# EAGLE design rgb_pov_single (EAGLE 5.01)
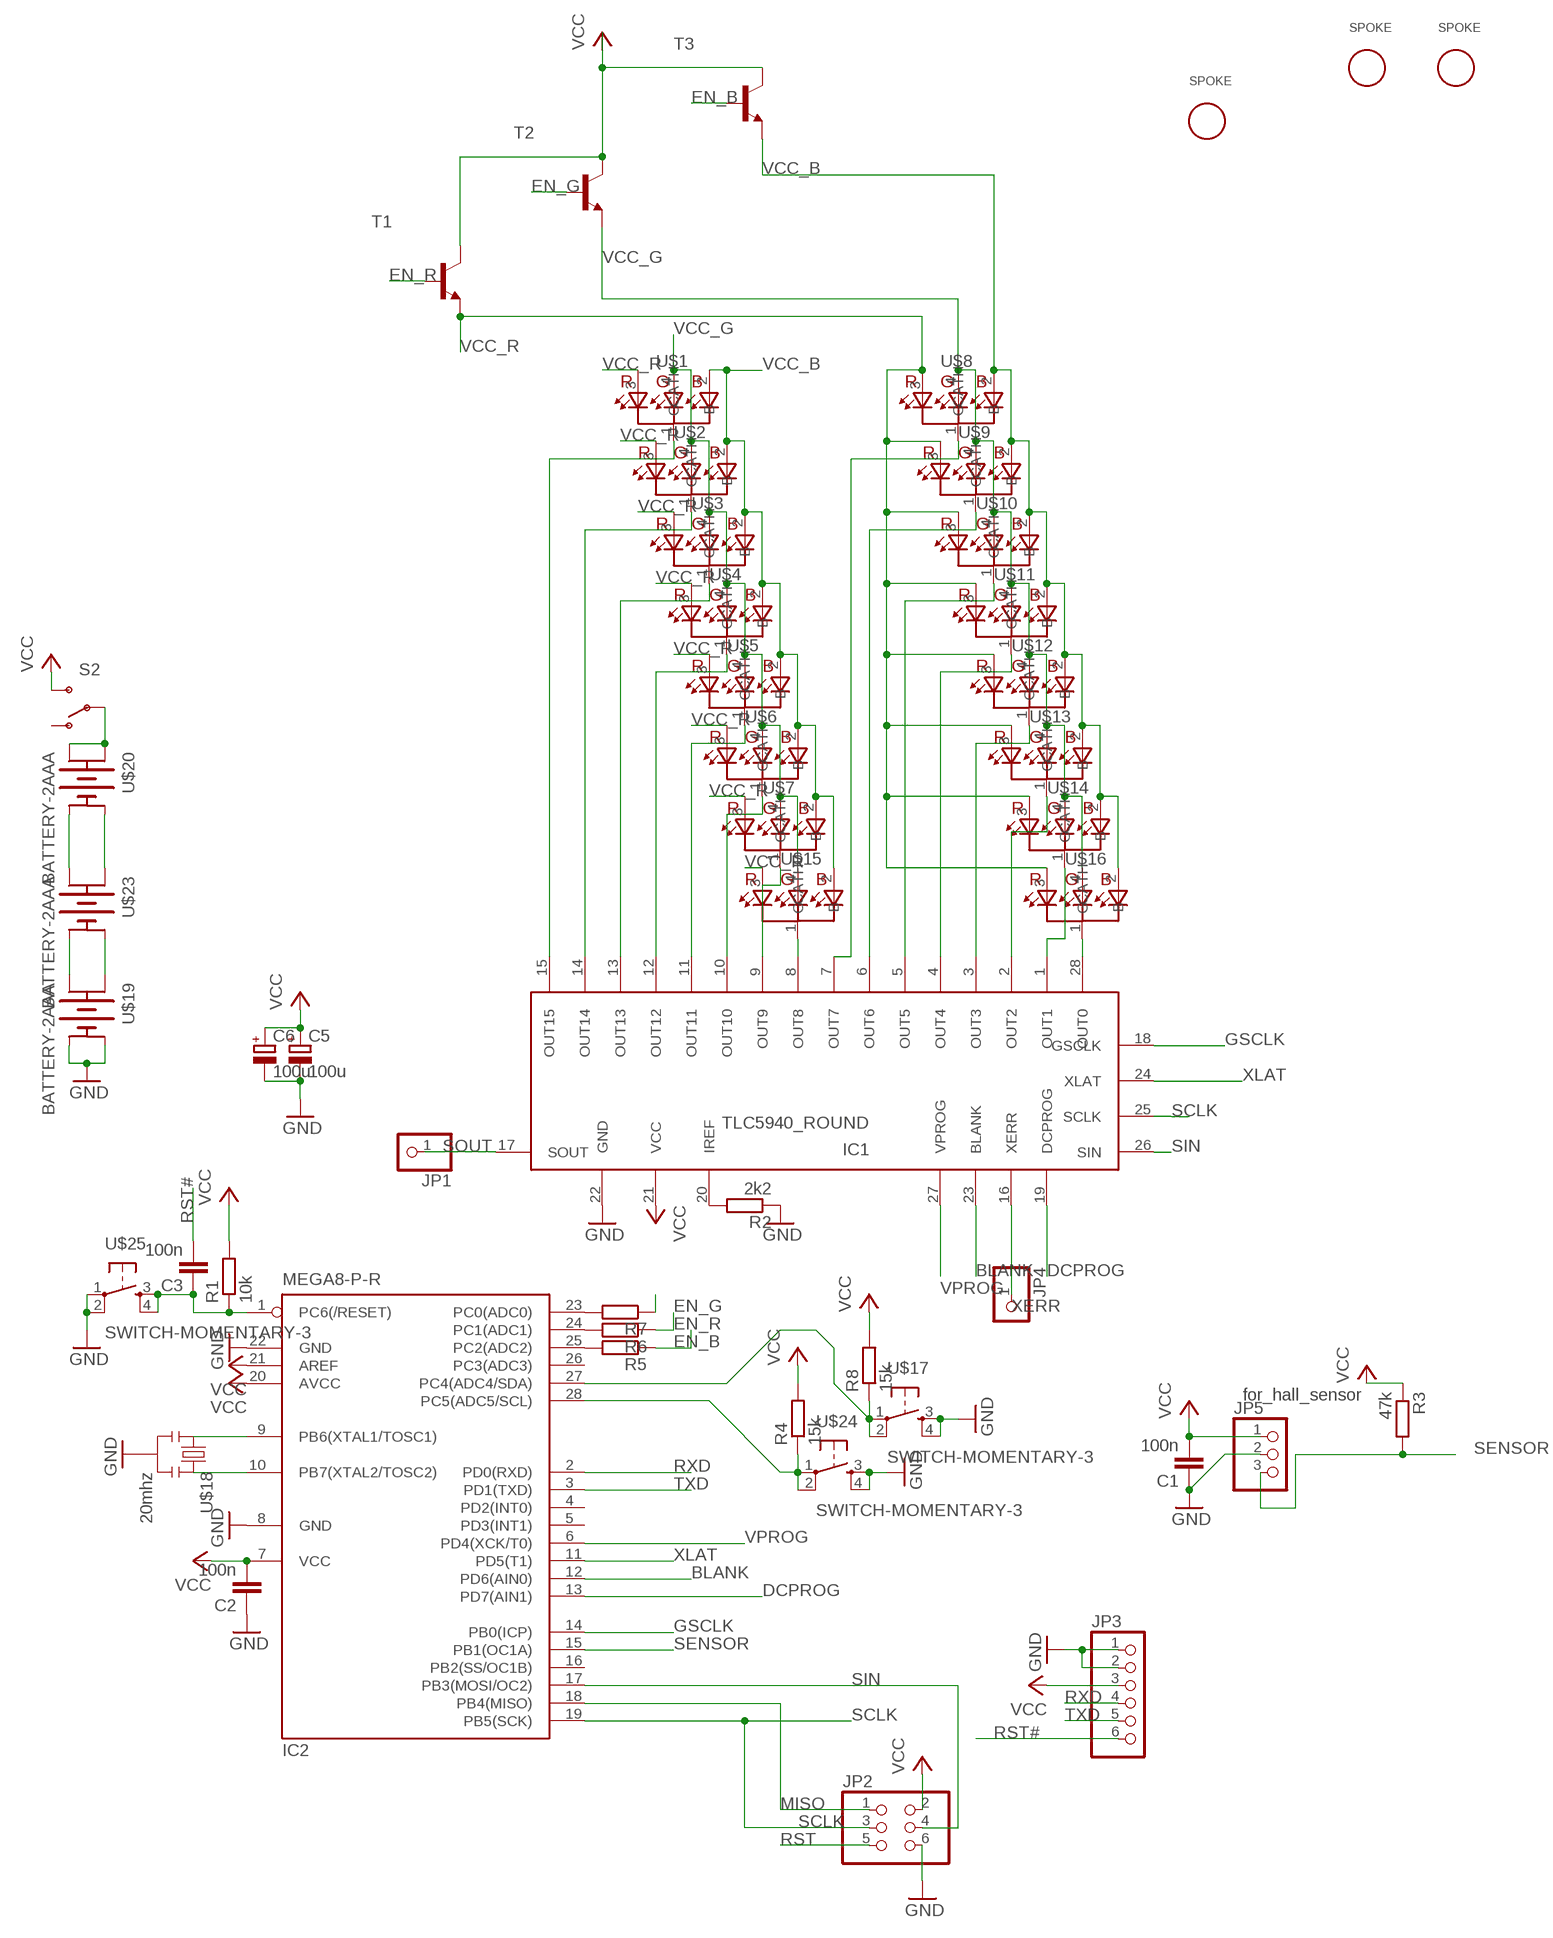
[diagram p0: schematic, sheet 1]

## Parts
1  SPOKE  [SPOKE]
2  SPOKE  [SPOKE]
3  SPOKE  [SPOKE]
C1  100n  C-EU025-025X050  [C025-025X050]
C2  100n  C-EU025-025X050  [C025-025X050]
C3  100n  C-EU025-025X050  [C025-025X050]
C5  100u  CPOL-EUE2,5-6E  [E2,5-6E]
C6  100u  CPOL-EUE2,5-6E  [E2,5-6E]
IC1  TLC5940_ROUND  [DIP28S_ROUND]
IC2  MEGA8-P-R  [DIL28-3-R]
JP1  PINHD-1X1_2  [1X01_2]
JP2  PINHD-2X3  [2X03]
JP3  PINHD-1X6  [1X06]
JP4  PINHD-1X1_2  [1X01_2]
JP5  PINHD-1X3_2  [1X03_2]
R1  10k  R-EU_0204/7  [0204/7]
R2  2k2  R-EU_0207/15  [0207/15]
R3  47k  R-EU_0207/10  [0207/10]
R4  15k  R-EU_0204/7  [0204/7]
R5  R-EU_0207/12  [0207/12]
R6  R-EU_0207/12  [0207/12]
R7  R-EU_0207/12  [0207/12]
R8  15k  R-EU_0204/7  [0204/7]
S2  SWITCH-SPSTPTH  [SWITCH-SPDT]
T1  2N2222-NPN-TO92-EBC  [TO92-EBC]
T2  2N2222-NPN-TO92-EBC  [TO92-EBC]
T3  2N2222-NPN-TO92-EBC  [TO92-EBC]
U$1  LED_SUPERFLUX_RGB_CATH  [LED_SUPERFLUX]
U$2  LED_SUPERFLUX_RGB_CATH  [LED_SUPERFLUX]
U$3  LED_SUPERFLUX_RGB_CATH  [LED_SUPERFLUX]
U$4  LED_SUPERFLUX_RGB_CATH  [LED_SUPERFLUX]
U$5  LED_SUPERFLUX_RGB_CATH  [LED_SUPERFLUX]
U$6  LED_SUPERFLUX_RGB_CATH  [LED_SUPERFLUX]
U$7  LED_SUPERFLUX_RGB_CATH  [LED_SUPERFLUX]
U$8  LED_SUPERFLUX_RGB_CATH  [LED_SUPERFLUX]
U$9  LED_SUPERFLUX_RGB_CATH  [LED_SUPERFLUX]
U$10  LED_SUPERFLUX_RGB_CATH  [LED_SUPERFLUX]
U$11  LED_SUPERFLUX_RGB_CATH  [LED_SUPERFLUX]
U$12  LED_SUPERFLUX_RGB_CATH  [LED_SUPERFLUX]
U$13  LED_SUPERFLUX_RGB_CATH  [LED_SUPERFLUX]
U$14  LED_SUPERFLUX_RGB_CATH  [LED_SUPERFLUX]
U$15  LED_SUPERFLUX_RGB_CATH  [LED_SUPERFLUX]
U$16  LED_SUPERFLUX_RGB_CATH  [LED_SUPERFLUX]
U$17  SWITCH-MOMENTARY-3  [TACTILE-PTH]
U$18  20mhz  RESONATORPTH  [RESONATOR-PTH]
U$19  BATTERY-2AAA  [BATTERY-AAA]
U$20  BATTERY-2AAA  [BATTERY-AAA]
U$23  BATTERY-2AAA  [BATTERY-AAA]
U$24  SWITCH-MOMENTARY-3  [TACTILE-PTH]
U$25  SWITCH-MOMENTARY-3  [TACTILE-PTH]

## Nets
BLANK: IC1.23(BLANK) IC2.12(PD6(AIN0))
DCPROG: IC1.19(DCPROG) IC2.13(PD7(AIN1))
EN_B: R5.1 T3.B
EN_G: R7.1 T2.B
EN_R: R6.1 T1.B
GND: C1.1 C2.1 C5.- C6.- IC1.22(GND) IC2.8(GND) IC2.22(GND) JP2.6 JP3.1 JP3.2 JP5.2 R2.1 U$17.3 U$17.4 U$18.2 U$19.GND@1(-1) U$19.GND@2(-2) U$24.3 U$24.4 U$25.1 U$25.2
GSCLK: IC1.18(GSCLK) IC2.14(PB0(ICP))
MISO: IC2.18(PB4(MISO)) JP2.1
N$1: IC1.28(OUT0) U$16.1(CATH)
N$2: IC1.1(OUT1) U$14.1(CATH)
N$3: IC1.2(OUT2) U$13.1(CATH)
N$4: IC1.3(OUT3) U$12.1(CATH)
N$5: IC1.4(OUT4) U$11.1(CATH)
N$6: IC1.5(OUT5) U$10.1(CATH)
N$7: IC1.6(OUT6) U$9.1(CATH)
N$8: IC1.7(OUT7) U$8.1(CATH)
N$9: IC1.20(IREF) R2.2
N$10: IC1.8(OUT8) U$15.1(CATH)
N$11: IC1.9(OUT9) U$7.1(CATH)
N$12: IC1.10(OUT10) U$6.1(CATH)
N$13: IC1.11(OUT11) U$5.1(CATH)
N$14: IC1.12(OUT12) U$4.1(CATH)
N$15: IC1.13(OUT13) U$3.1(CATH)
N$16: IC1.14(OUT14) U$2.1(CATH)
N$17: IC1.15(OUT15) U$1.1(CATH)
N$18: U$20.GND@2(-2) U$23.PWR@2(+2)
N$19: IC2.10(PB7(XTAL2/TOSC2)) U$18.3
N$20: IC2.9(PB6(XTAL1/TOSC1)) U$18.1
N$21: U$20.GND@1(-1) U$23.PWR@1(+1)
N$22: U$19.PWR@1(+1) U$23.GND@1(-1)
N$23: U$19.PWR@2(+2) U$23.GND@2(-2)
N$24: IC2.28(PC5(ADC5/SCL)) R4.1 U$24.1 U$24.2
N$25: S2.2(P) U$20.PWR@1(+1) U$20.PWR@2(+2)
N$26: IC2.25(PC2(ADC2)) R5.2
N$27: IC2.24(PC1(ADC1)) R6.2
N$28: IC2.23(PC0(ADC0)) R7.2
N$29: IC2.27(PC4(ADC4/SDA)) R8.1 U$17.1 U$17.2
RST: C3.1 IC2.1(PC6(/RESET)) JP2.5 R1.1 U$25.3 U$25.4
RST#: C3.2 JP3.6
RXD: IC2.2(PD0(RXD)) JP3.4
SCLK: IC1.25(SCLK) IC2.19(PB5(SCK)) JP2.3
SENSOR: IC2.15(PB1(OC1A)) JP5.3 R3.2
SIN: IC1.26(SIN) IC2.17(PB3(MOSI/OC2)) JP2.4
SOUT: IC1.17(SOUT) JP1.1
TXD: IC2.3(PD1(TXD)) JP3.5
VCC: C1.2 C2.2 C5.+ C6.+ IC1.21(VCC) IC2.7(VCC) IC2.20(AVCC) IC2.21(AREF) JP2.2 JP3.3 JP5.1 R1.2 R3.1 R4.2 R8.2 S2.3(S) T1.C T2.C T3.C
VCC_B: T3.E U$1.2(B) U$2.2(B) U$3.2(B) U$4.2(B) U$5.2(B) U$6.2(B) U$7.2(B) U$8.2(B) U$9.2(B) U$10.2(B) U$11.2(B) U$12.2(B) U$13.2(B) U$14.2(B) U$15.2(B) U$16.2(B)
VCC_G: T2.E U$1.4(G) U$2.4(G) U$3.4(G) U$4.4(G) U$5.4(G) U$6.4(G) U$7.4(G) U$8.4(G) U$9.4(G) U$10.4(G) U$11.4(G) U$12.4(G) U$13.4(G) U$14.4(G) U$15.4(G) U$16.4(G)
VCC_R: T1.E U$1.3(R) U$2.3(R) U$3.3(R) U$4.3(R) U$5.3(R) U$6.3(R) U$7.3(R) U$8.3(R) U$9.3(R) U$10.3(R) U$11.3(R) U$12.3(R) U$13.3(R) U$14.3(R) U$15.3(R) U$16.3(R)
VPROG: IC1.27(VPROG) IC2.6(PD4(XCK/T0))
XERR: IC1.16(XERR) JP4.1
XLAT: IC1.24(XLAT) IC2.11(PD5(T1))
Unconnected: IC2.4(PD2(INT0)) IC2.5(PD3(INT1)) IC2.16(PB2(SS/OC1B)) IC2.26(PC3(ADC3)) S2.1(O)

## Notes on the sheet
- for_hall_sensor

## Library data of the parts
1-3 = hazard:SPOKE
C1-C3 = rcl:C-EU: CAPACITOR, European symbol
C5 C6 = rcl:CPOL-EU: POLARIZED CAPACITOR, European symbol
IC1 = hazard:TLC5940: TLC5940 16 CHANNEL LED DRIVER WITH DOT CORRECTION AND GRAYSCALE PWM CONTROL
IC2 = atmel:MEGA8-P: MICROCONTROLLER 8 Kbytes FLASH, 1 kbytes SRAM, 512 bytes EEPROM, USART, 4-channel 10 bit ADC, 2-channel 8 bit ADC Pin compatible with Atmega48, ATMega88, ATMega168 Source: avr.lbr
JP1 JP4 = pinhead:PINHD-1X1: PIN HEADER
JP2 = pinhead:PINHD-2X3: PIN HEADER
JP3 = pinhead:PINHD-1X6: PIN HEADER
JP5 = pinhead:PINHD-1X3: PIN HEADER
R1-R8 = rcl:R-EU_: RESISTOR, European symbol
S2 = SparkFun:SWITCH-SPST: SPST Switch Simple slide switch. Spark Fun Electronics SKU : COM-00102
T1-T3 = transistor-neu-to92:*-NPN-: NPN Transistror
U$1-U$16 = hazard:LED_SUPERFLUX_RGB_CATH
U$17 U$24 U$25 = SparkFun:SWITCH-MOMENTARY-3
U$18 = SparkFun:RESONATOR: Resonator Small SMD resonator. This is the itty bitty 10/20MHz resonators with built in caps. CSTCE10M0G55 and CSTCE20M0V53. Footprint has been reviewed closely but hasn't been tested yet.
U$19 U$20 U$23 = SparkFun:BATTERY-2

## Board
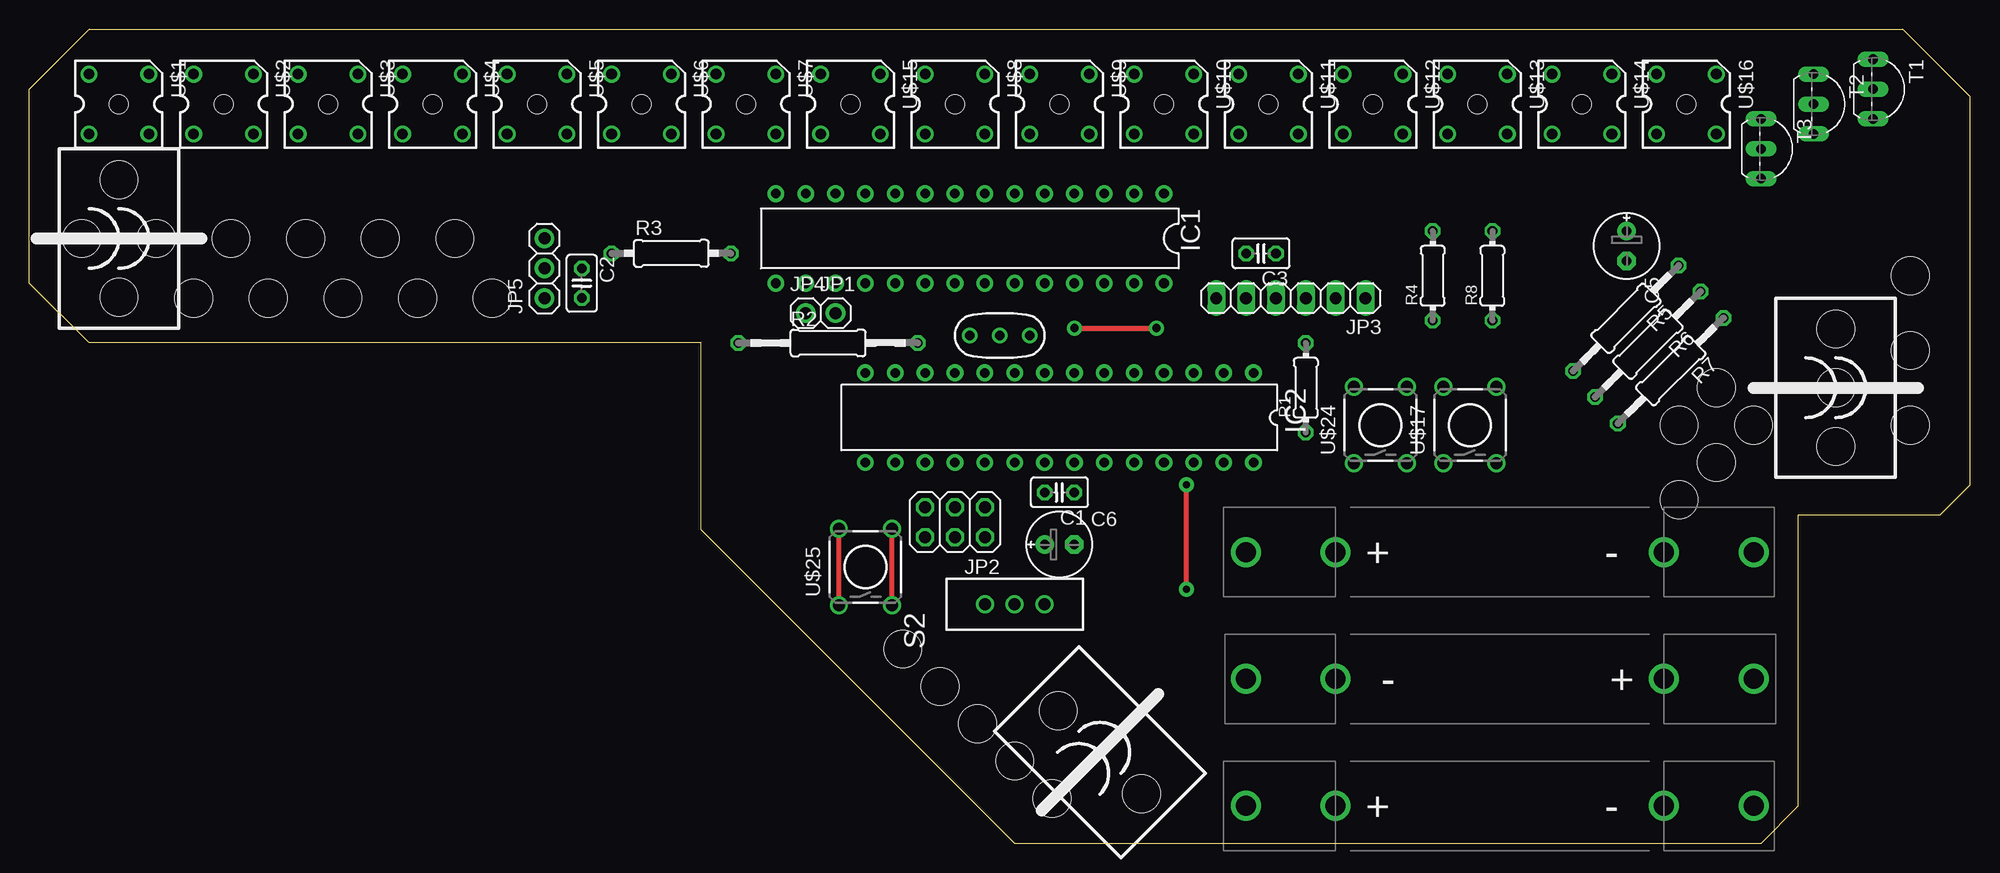
[diagram p1: board, top side]
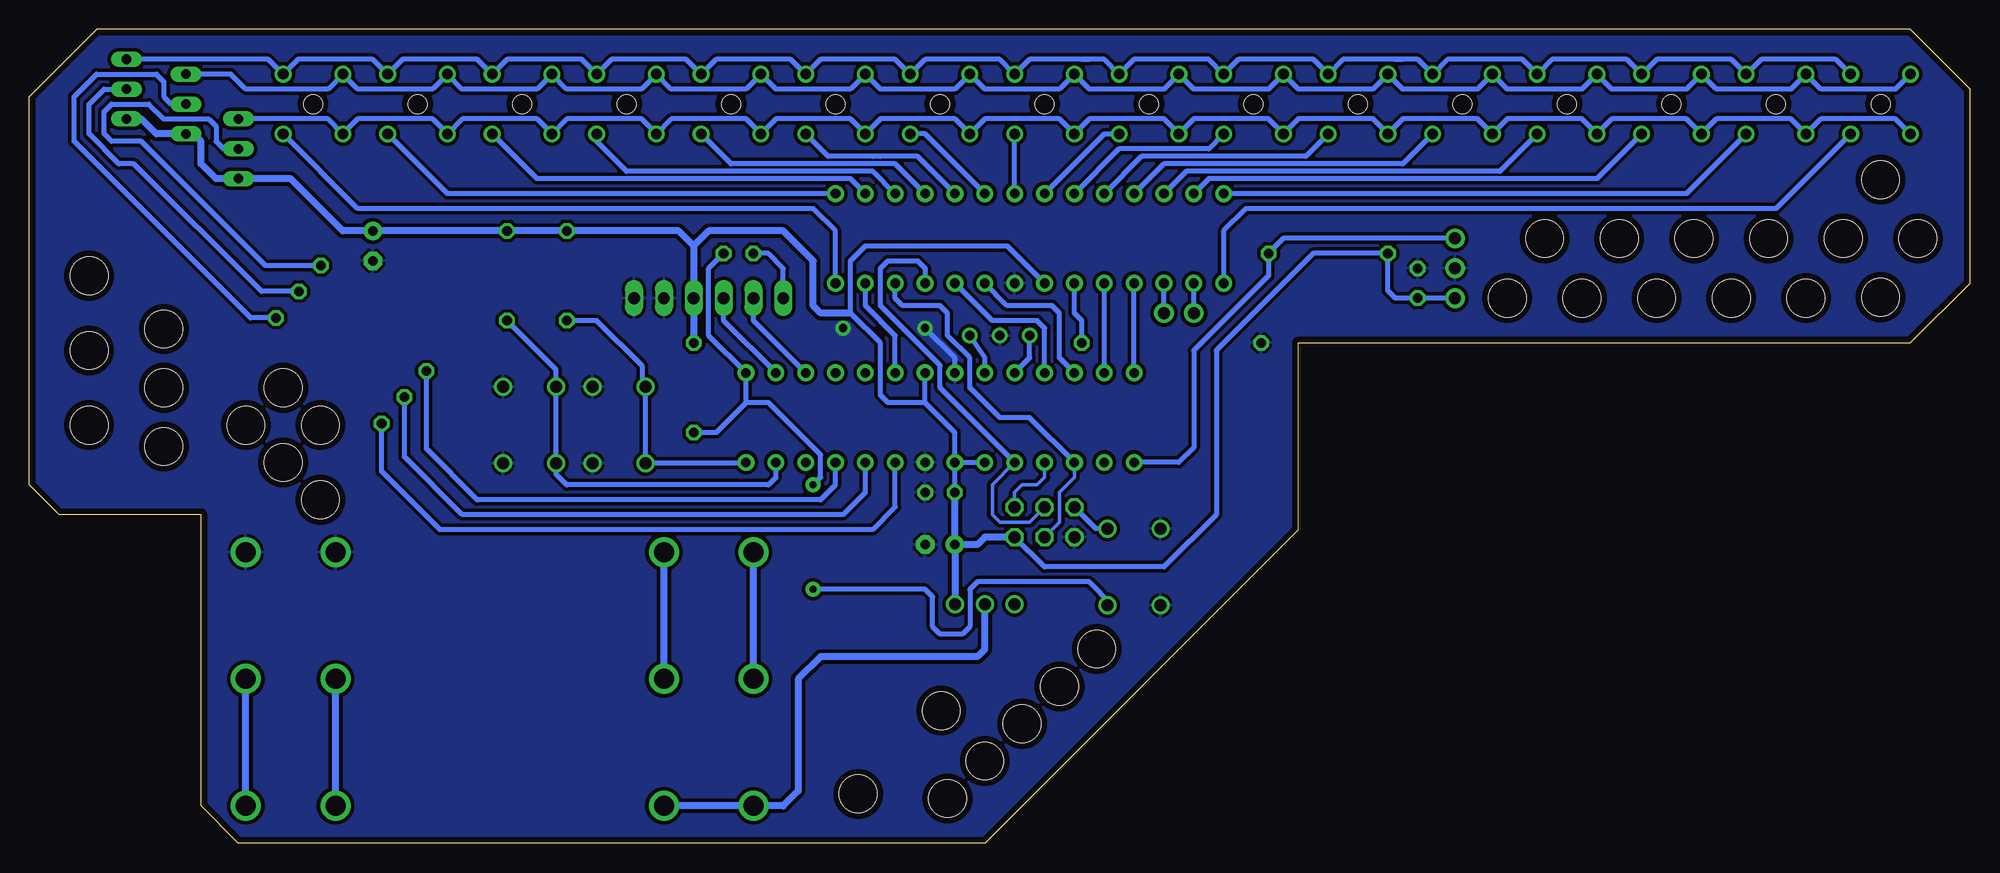
[diagram p2: board, bottom side, seen from below]

Size 165.1 x 69.21 mm. Coordinates in mm from the lower left corner, seen from the top.
Outline: 57.15,26.67 57.15,42.55 5.08,42.55 0,47.62 0,64.13 5.08,69.21 159.38,69.21 165.1,63.5 165.1,30.48 162.56,27.94 150.5,27.94 150.5,3.17 147.32,0 83.82,0 57.15,26.67
Copper layers (1*16): Top 0.035mm / dielectric 1.5mm / Bottom 0.035mm
Design rules "default *": minimum track width 10mil, minimum drill 24mil, track to track 12mil, track to pad 12mil, pad to pad 12mil, via to via 12mil, smd to smd 8mil, copper to edge 20mil, drill to drill 8mil, minimum pad ring 10mil, minimum via ring 8mil, stop-mask expansion 4mil, vias tented up to drill 0mil, thermal gap 10mil
Holes 1.6 mm at 7.62,62.87 16.51,62.87 25.4,62.87 34.29,62.87 43.18,62.87 52.07,62.87 60.96,62.87 69.85,62.87 78.74,62.87 87.63,62.87 96.52,62.87 105.41,62.87 114.3,62.87 123.19,62.87 132.08,62.87 140.97,62.87
Holes 3.2 mm at 13.97,46.36 20.32,46.36 26.67,46.36 33.02,46.36 39.37,46.36 36.2,51.44 29.85,51.44 23.5,51.44 17.15,51.44 10.79,51.44 4.45,51.44 153.67,38.73 160.02,35.56 160.02,41.91 160.02,48.26 146.69,35.56 143.51,38.73 143.51,32.39 140.33,35.56 140.33,29.21 87,3.81 83.82,6.99 74.3,16.51 80.65,10.16 77.47,13.34

### Footprints (pad centres in the part's own frame; a part is rotated, then mirrored left to right if it is on the bottom)
SPOKE = hole 3.2: 0,-5; 0,5
C025-025X050 = drill 0.813 octagon: 1 -1.27,0; 2 1.27,0
E2,5-6E = drill 0.813 pad 1.575 round: + -1.27,0 | drill 0.813 pad 1.575 octagon: - 1.27,0
DIP28S_ROUND = drill 0.813 pad 1.422 round: 1 0,0; 2 2.54,0; 3 5.08,0; 4 7.62,0; 5 10.16,0; 6 12.7,0; 7 15.24,0; 8 17.78,0; 9 20.32,0; 10 22.86,0; 11 25.4,0; 12 27.94,0; 13 30.48,0; 14 33.02,0; 15 33.02,7.62; 16 30.48,7.62; 17 27.94,7.62; 18 25.4,7.62; 19 22.86,7.62; 20 20.32,7.62; 21 17.78,7.62; 22 15.24,7.62; 23 12.7,7.62; 24 10.16,7.62; 25 7.62,7.62; 26 5.08,7.62; 27 2.54,7.62; 28 0,7.62
DIL28-3-R = drill 0.813 pad 1.422 round: 1 -16.51,-3.81; 2 -13.97,-3.81; 3 -11.43,-3.81; 4 -8.89,-3.81; 5 -6.35,-3.81; 6 -3.81,-3.81; 7 -1.27,-3.81; 8 1.27,-3.81; 9 3.81,-3.81; 10 6.35,-3.81; 11 8.89,-3.81; 12 11.43,-3.81; 13 13.97,-3.81; 14 16.51,-3.81; 15 16.51,3.81; 16 13.97,3.81; 17 11.43,3.81; 18 8.89,3.81; 19 6.35,3.81; 20 3.81,3.81; 21 1.27,3.81; 22 -1.27,3.81; 23 -3.81,3.81; 24 -6.35,3.81; 25 -8.89,3.81; 26 -11.43,3.81; 27 -13.97,3.81; 28 -16.51,3.81
1X01_2 = drill 1.016 pad 1.676 round: 1 0,0
2X03 = drill 1.016 octagon: 1 -2.54,-1.27; 2 -2.54,1.27; 3 0,-1.27; 4 0,1.27; 5 2.54,-1.27; 6 2.54,1.27
1X06 = drill 1.016 long: 1 -6.35,0; 2 -3.81,0; 3 -1.27,0; 4 1.27,0; 5 3.81,0; 6 6.35,0
1X03_2 = drill 1.016 pad 1.676 round: 1 -2.54,0; 2 0,0; 3 2.54,0
0204/7 = drill 0.813 octagon: 1 -3.81,0; 2 3.81,0
0207/15 = drill 0.813 octagon: 1 -7.62,0; 2 7.62,0
0207/10 = drill 0.813 octagon: 1 -5.08,0; 2 5.08,0
0207/12 = drill 0.813 octagon: 1 -6.35,0; 2 6.35,0
SWITCH-SPDT = drill 1.016 round: 1 0,2.54; 2 0,0; 3 0,-2.54
TO92-EBC = drill 0.813 long: B 0,-1.27; C 2.54,-1.27; E -2.54,-1.27
LED_SUPERFLUX = drill 0.9 pad 1.422 round: 1 0,5.08; 2 5.08,5.08; 3 0,0; 4 5.08,0
TACTILE-PTH = drill 1.016 round: 1 -3.251,2.261; 2 3.251,2.261; 3 -3.251,-2.261; 4 3.251,-2.261
RESONATOR-PTH = drill 0.8 round: 1 -2.54,0; 2 0,0; 3 2.54,0
BATTERY-AAA = drill 1.702 round: GND@1 21.59,0; GND@2 13.97,0; PWR@1 -21.59,0; PWR@2 -13.97,0

### Placement (x,y rotation side)
1  7.62,51.44 0 top
2  153.67,38.73 0 top
3  91.07,7.74 45 top
C1  87.63,29.84 180 top
C2  46.99,47.62 270 top
C3  104.78,50.16 180 top
C5  135.89,50.8 270 top
C6  87.63,25.4 0 top
IC1  96.52,55.25 180 top
IC2  87.63,36.2 180 top
JP1  68.58,45.09 0 top
JP2  78.74,27.3 180 top
JP3  107.32,46.36 180 top
JP4  66.04,45.09 0 top
JP5  43.81,48.9 90 top
R1  108.59,38.73 90 top
R2  67.95,42.55 0 top
R3  54.61,50.16 0 top
R4  119.38,48.26 90 top
R5  135.81,44.64 225 top
R6  137.69,42.44 225 top
R7  139.62,40.19 225 top
R8  124.46,48.26 90 top
S2  83.82,20.32 90 top
T1  158.11,64.13 270 top
T2  153.03,62.87 270 top
T3  148.59,59.05 270 top
U$1  10.16,65.41 180 top
U$2  19.05,65.41 180 top
U$3  27.94,65.41 180 top
U$4  36.83,65.41 180 top
U$5  45.72,65.41 180 top
U$6  54.61,65.41 180 top
U$7  63.5,65.41 180 top
U$8  81.28,65.41 180 top
U$9  90.17,65.41 180 top
U$10  99.06,65.41 180 top
U$11  107.95,65.41 180 top
U$12  116.84,65.41 180 top
U$13  125.73,65.41 180 top
U$14  134.62,65.41 180 top
U$15  72.39,65.41 180 top
U$16  143.51,65.41 180 top
U$17  122.56,35.56 90 top
U$18  82.55,43.18 180 top
U$19  125.09,24.76 0 top
U$20  125.09,3.17 0 top
U$23  125.09,13.97 180 top
U$24  114.94,35.56 90 top
U$25  71.12,23.49 90 top

### Tracks (layer width: path | path; a pad name or v marks a point on that pad's centre or on a via)
BLANK
  Bottom 0.406: IC2.12 77.47,41.27 77.47,45.09 78.11,45.72 81.92,45.72 IC1.23
DCPROG
  Bottom 0.406: IC2.13 IC1.19
EN_B
  Bottom 0.406: T3.B 148.59,59.05 149.22,59.69 149.22,60.96 149.86,61.59 153.67,61.59 154.94,62.87 158.11,62.87 158.75,62.23 158.75,60.33 158.11,59.69 155.57,59.69 145.01,49.13 R5.1
EN_G
  Bottom 0.406: T2.B 153.03,62.87 153.67,63.5 153.67,64.77 154.3,65.41 159.38,65.41 161.29,63.5 161.29,59.69 146.28,44.68 R7.1
EN_R
  Bottom 0.406: T1.B 158.75,64.13 160.02,62.87 160.02,60.33 157.48,57.79 156.21,57.79 145.35,46.93 R6.1
GND  (via drill 0.7 pad 1.27)
  Top 0.406: v88.9,43.82 v95.89,43.82 | U$25.1 68.66,20.24 68.58,20.32 68.86,20.6 U$25.2
  Bottom 0.406: IC2.8 86.36,41.27 v88.9,43.82
  pour Bottom: 83.82,0 147.32,0 150.5,3.17 150.5,27.94 162.56,27.94 165.1,30.48 165.1,63.5 159.38,69.21 5.08,69.21 0,64.13 0,47.62 5.08,42.55 57.15,42.55 57.15,26.67
GSCLK
  Bottom 0.406: IC2.14 IC1.18
MISO
  Bottom 0.305: JP2.1 81.28,29.84 80.65,30.48 79.38,30.48 78.74,31.11 IC2.18
N$1
  Bottom 0.406: 132.72,53.98 98.43,53.98 96.52,52.07 IC1.28 | 132.72,53.98 133.35,53.98 | U$16.1 137.16,53.98 132.72,53.98
N$2
  Bottom 0.406: U$14.1 129.54,55.25 IC1.1
N$3
  Bottom 0.406: IC1.2 95.25,56.52 121.92,56.52 U$13.1
N$4
  Bottom 0.406: IC1.3 93.34,57.15 114.3,57.15 116.84,59.69 U$12.1
N$5
  Bottom 0.406: IC1.4 91.44,57.79 105.41,57.79 U$11.1
N$6
  Bottom 0.406: IC1.5 89.54,58.42 92.71,58.42 | 92.71,58.42 93.34,58.42 | U$10.1 97.16,58.42 92.71,58.42
N$7
  Bottom 0.406: U$9.1 88.9,60.33 IC1.6
N$8
  Bottom 0.406: IC1.7 U$8.1
N$9
  Bottom 0.406: R2.2 75.57,44.45 76.2,45.09 IC1.20
N$10
  Bottom 0.406: IC1.8 73.66,60.33 U$15.1
N$11
  Bottom 0.406: IC1.9 72.39,59.05 64.77,59.05 U$7.1
N$12
  Bottom 0.406: IC1.10 70.48,58.42 56.52,58.42 U$6.1
N$13
  Bottom 0.406: IC1.11 68.58,57.79 48.26,57.79 U$5.1
N$14
  Bottom 0.406: IC1.12 66.68,57.15 40,57.15 U$4.1
N$15
  Bottom 0.406: IC1.13 64.77,56.52 31.75,56.52 U$3.1
N$16
  Bottom 0.406: IC1.14 24.13,55.25 U$2.1
N$17
  Bottom 0.406: IC1.15 63.5,52.07 61.59,53.98 16.51,53.98 U$1.1
N$18
  Bottom 0.61: U$20.GND@2 U$23.PWR@2
N$19
  Bottom 0.406: IC2.10 80.01,41.27 U$18.3
N$20
  Bottom 0.406: IC2.9 83.82,41.27 U$18.1
N$21
  Bottom 0.61: U$20.GND@1 U$23.PWR@1
N$22
  Bottom 0.61: U$23.GND@1 U$19.PWR@1
N$23
  Bottom 0.61: U$23.GND@2 U$19.PWR@2
N$24
  Bottom 0.406: IC2.28 104.22,32.31 U$24.1 112.67,38.38 113.03,38.73 112.95,38.81 | 112.95,38.81 U$24.2 | 112.95,38.81 112.95,40.56 116.84,44.45 R4.1
N$25
  Bottom 0.61: U$20.PWR@2 U$20.PWR@1 100.97,3.17 99.7,4.45 99.7,13.97 97.79,15.88 84.45,15.88 83.82,16.51 S2.2
N$26
  Bottom 0.406: IC2.25 96.52,30.48 97.79,29.21 127,29.21 131.32,33.53 R5.2
N$27
  Bottom 0.406: IC2.24 93.98,29.84 95.89,27.94 128.27,27.94 133.2,32.87 R6.2
N$28
  Bottom 0.406: IC2.23 91.44,28.57 93.34,26.67 130.17,26.67 135.13,31.63 R7.2
N$29
  Bottom 0.406: IC2.27 101.6,31.11 102.23,30.48 119.38,30.48 120.29,31.39 U$17.1 120.29,38.46 120.02,38.73 120.09,38.81 U$17.2 120.29,40.28 R8.1
RST  (via drill 0.6 pad 1.27)
  Top 0.406: U$25.4 73.58,26.75 73.66,26.67 73.38,26.39 U$25.3 | v98.43,21.59 v98.43,30.48
  Bottom 0.406: C3.1 107.32,48.9 107.32,43.18 IC2.1 104.14,37.47 | 104.14,37.47 102.23,37.47 97.79,33.02 97.79,31.11 v98.43,30.48 | U$25.4 74.37,26.75 JP2.5 | U$25.3 73.1,20.24 73.03,20.32 74.93,22.22 84.45,22.22 85.09,21.59 85.09,18.41 85.73,17.78 87.63,17.78 88.27,18.41 88.27,20.95 88.9,21.59 v98.43,21.59 | R1.1 106.68,34.93 104.14,37.47
RST#
  Bottom 0.406: C3.2 102.23,50.16 100.97,48.9 JP3.6
RXD
  Bottom 0.406: JP3.4 106.05,44.45 IC2.2
SCLK
  Bottom 0.305: JP2.3 80.01,27.3 82.55,27.3 83.19,27.94 83.19,30.48 IC2.19
  Bottom 0.406: IC1.25 88.9,48.9 89.54,49.53 92.08,49.53 92.71,48.9 92.71,45.72 87.63,40.64 87.63,38.73 IC2.19
SENSOR
  Bottom 0.406: IC2.15 67.31,32.39 66.04,33.66 66.04,41.91 59.69,48.26 R3.2 58.42,51.44 JP5.3
SIN
  Bottom 0.305: JP2.4 77.47,27.3 77.47,29.84 76.2,31.11 IC2.17
  Bottom 0.406: IC2.17 80.01,36.2 82.55,36.2 85.09,38.73 85.09,41.27 87,43.18 87,45.09 87.63,45.72 90.81,45.72 91.44,46.36 IC1.26
SOUT
  Bottom 0.406: JP1.1 IC1.17
TXD
  Bottom 0.406: JP3.5 103.51,44.45 IC2.3
VCC
  Bottom 0.406: IC2.21 IC2.20 | IC2.21 86.36,34.93 88.9,37.47 | 88.9,37.47 IC2.7 | IC1.21 81.92,50.8 93.98,50.8 95.25,49.53 95.25,45.09 92.71,42.55 92.71,38.1 92.08,37.47 88.9,37.47 | C1.2 IC2.21 | JP2.2 78.74,23.49 68.58,23.49 64.14,27.94 64.14,41.91 55.88,50.16 R3.1 49.53,46.99 48.89,46.36 C2.2 JP5.1
  Bottom 0.61: 108.59,50.8 JP3.3 R1.2 | 108.59,50.8 107.32,52.07 100.97,52.07 98.43,49.53 98.43,45.72 97.79,45.09 95.25,45.09 | 108.59,50.8 109.86,52.07 R4.2 R8.2 C5.+ 138.43,52.07 142.88,56.52 T3.C 149.22,56.52 150.5,57.79 150.5,59.69 151.13,60.33 T2.C 154.3,60.33 155.57,61.59 T1.C | C6.+ C1.2 | C6.+ S2.3 | JP2.2 83.82,26.04 84.45,25.4 C6.+
VCC_B
  Bottom 0.406: U$1.2 6.35,61.59 12.7,61.59 U$2.2 15.24,61.59 21.59,61.59 U$3.2 24.13,61.59 30.48,61.59 U$4.2 33.02,61.59 39.37,61.59 U$5.2 41.91,61.59 48.26,61.59 U$6.2 50.8,61.59 57.15,61.59 U$7.2 59.69,61.59 66.04,61.59 U$15.2 68.58,61.59 74.93,61.59 U$8.2 77.47,61.59 83.82,61.59 U$9.2 86.36,61.59 92.71,61.59 U$10.2 95.25,61.59 101.6,61.59 U$11.2 104.14,61.59 110.49,61.59 U$12.2 113.03,61.59 119.38,61.59 U$13.2 121.92,61.59 128.27,61.59 U$14.2 130.81,61.59 137.16,61.59 U$16.2 139.7,61.59 T3.E
VCC_G
  Bottom 0.406: 81.92,64.13 77.47,64.13 U$8.4 74.93,64.13 68.58,64.13 U$15.4 66.04,64.13 59.69,64.13 U$7.4 57.15,64.13 50.8,64.13 U$6.4 48.26,64.13 41.91,64.13 U$5.4 39.37,64.13 33.02,64.13 U$4.4 30.48,64.13 24.13,64.13 U$3.4 21.59,64.13 15.24,64.13 U$2.4 12.7,64.13 6.35,64.13 U$1.4 | 81.92,64.13 82.55,64.13 | 81.92,64.13 83.82,64.13 U$9.4 86.36,64.13 92.71,64.13 U$10.4 95.25,64.13 101.6,64.13 U$11.4 104.14,64.13 110.49,64.13 U$12.4 113.03,64.13 119.38,64.13 U$13.4 121.92,64.13 128.27,64.13 U$14.4 130.81,64.13 137.16,64.13 U$16.4 139.7,64.13 146.69,64.13 147.95,65.41 T2.E
VCC_R
  Bottom 0.406: 75.57,66.67 74.93,66.67 | 75.57,66.67 80.01,66.67 U$8.3 82.55,66.67 88.9,66.67 U$9.3 91.44,66.67 97.79,66.67 U$10.3 100.33,66.67 106.68,66.67 U$11.3 109.22,66.67 115.57,66.67 U$12.3 118.11,66.67 124.46,66.67 U$13.3 127,66.67 133.35,66.67 U$14.3 135.89,66.67 142.24,66.67 U$16.3 144.78,66.67 T1.E | 48.89,66.67 48.26,66.67 | 48.89,66.67 53.34,66.67 U$6.3 55.88,66.67 62.23,66.67 U$7.3 64.77,66.67 71.12,66.67 U$15.3 73.66,66.67 75.57,66.67 | U$1.3 11.43,66.67 17.78,66.67 U$2.3 20.32,66.67 26.67,66.67 U$3.3 29.21,66.67 35.56,66.67 U$4.3 38.1,66.67 44.45,66.67 U$5.3 46.99,66.67 48.89,66.67
VPROG
  Bottom 0.406: IC1.27 93.98,45.72 91.44,43.18 IC2.6
XERR
  Bottom 0.406: JP4.1 IC1.16
XLAT
  Bottom 0.406: IC2.11 78.74,43.82 79.38,44.45 83.19,44.45 IC1.24